# EasyEDA schematic SCH_Smart_Card_Contactless_Raspberry_Pi_2022-03-11.json
TITLE: Smart Card Contactless Raspberry Pi; REV: 1.0; Date: 2022-03-11; Sheet: 1/1; Drawn By: amusarra; Company: Antonio Musarra's Blog
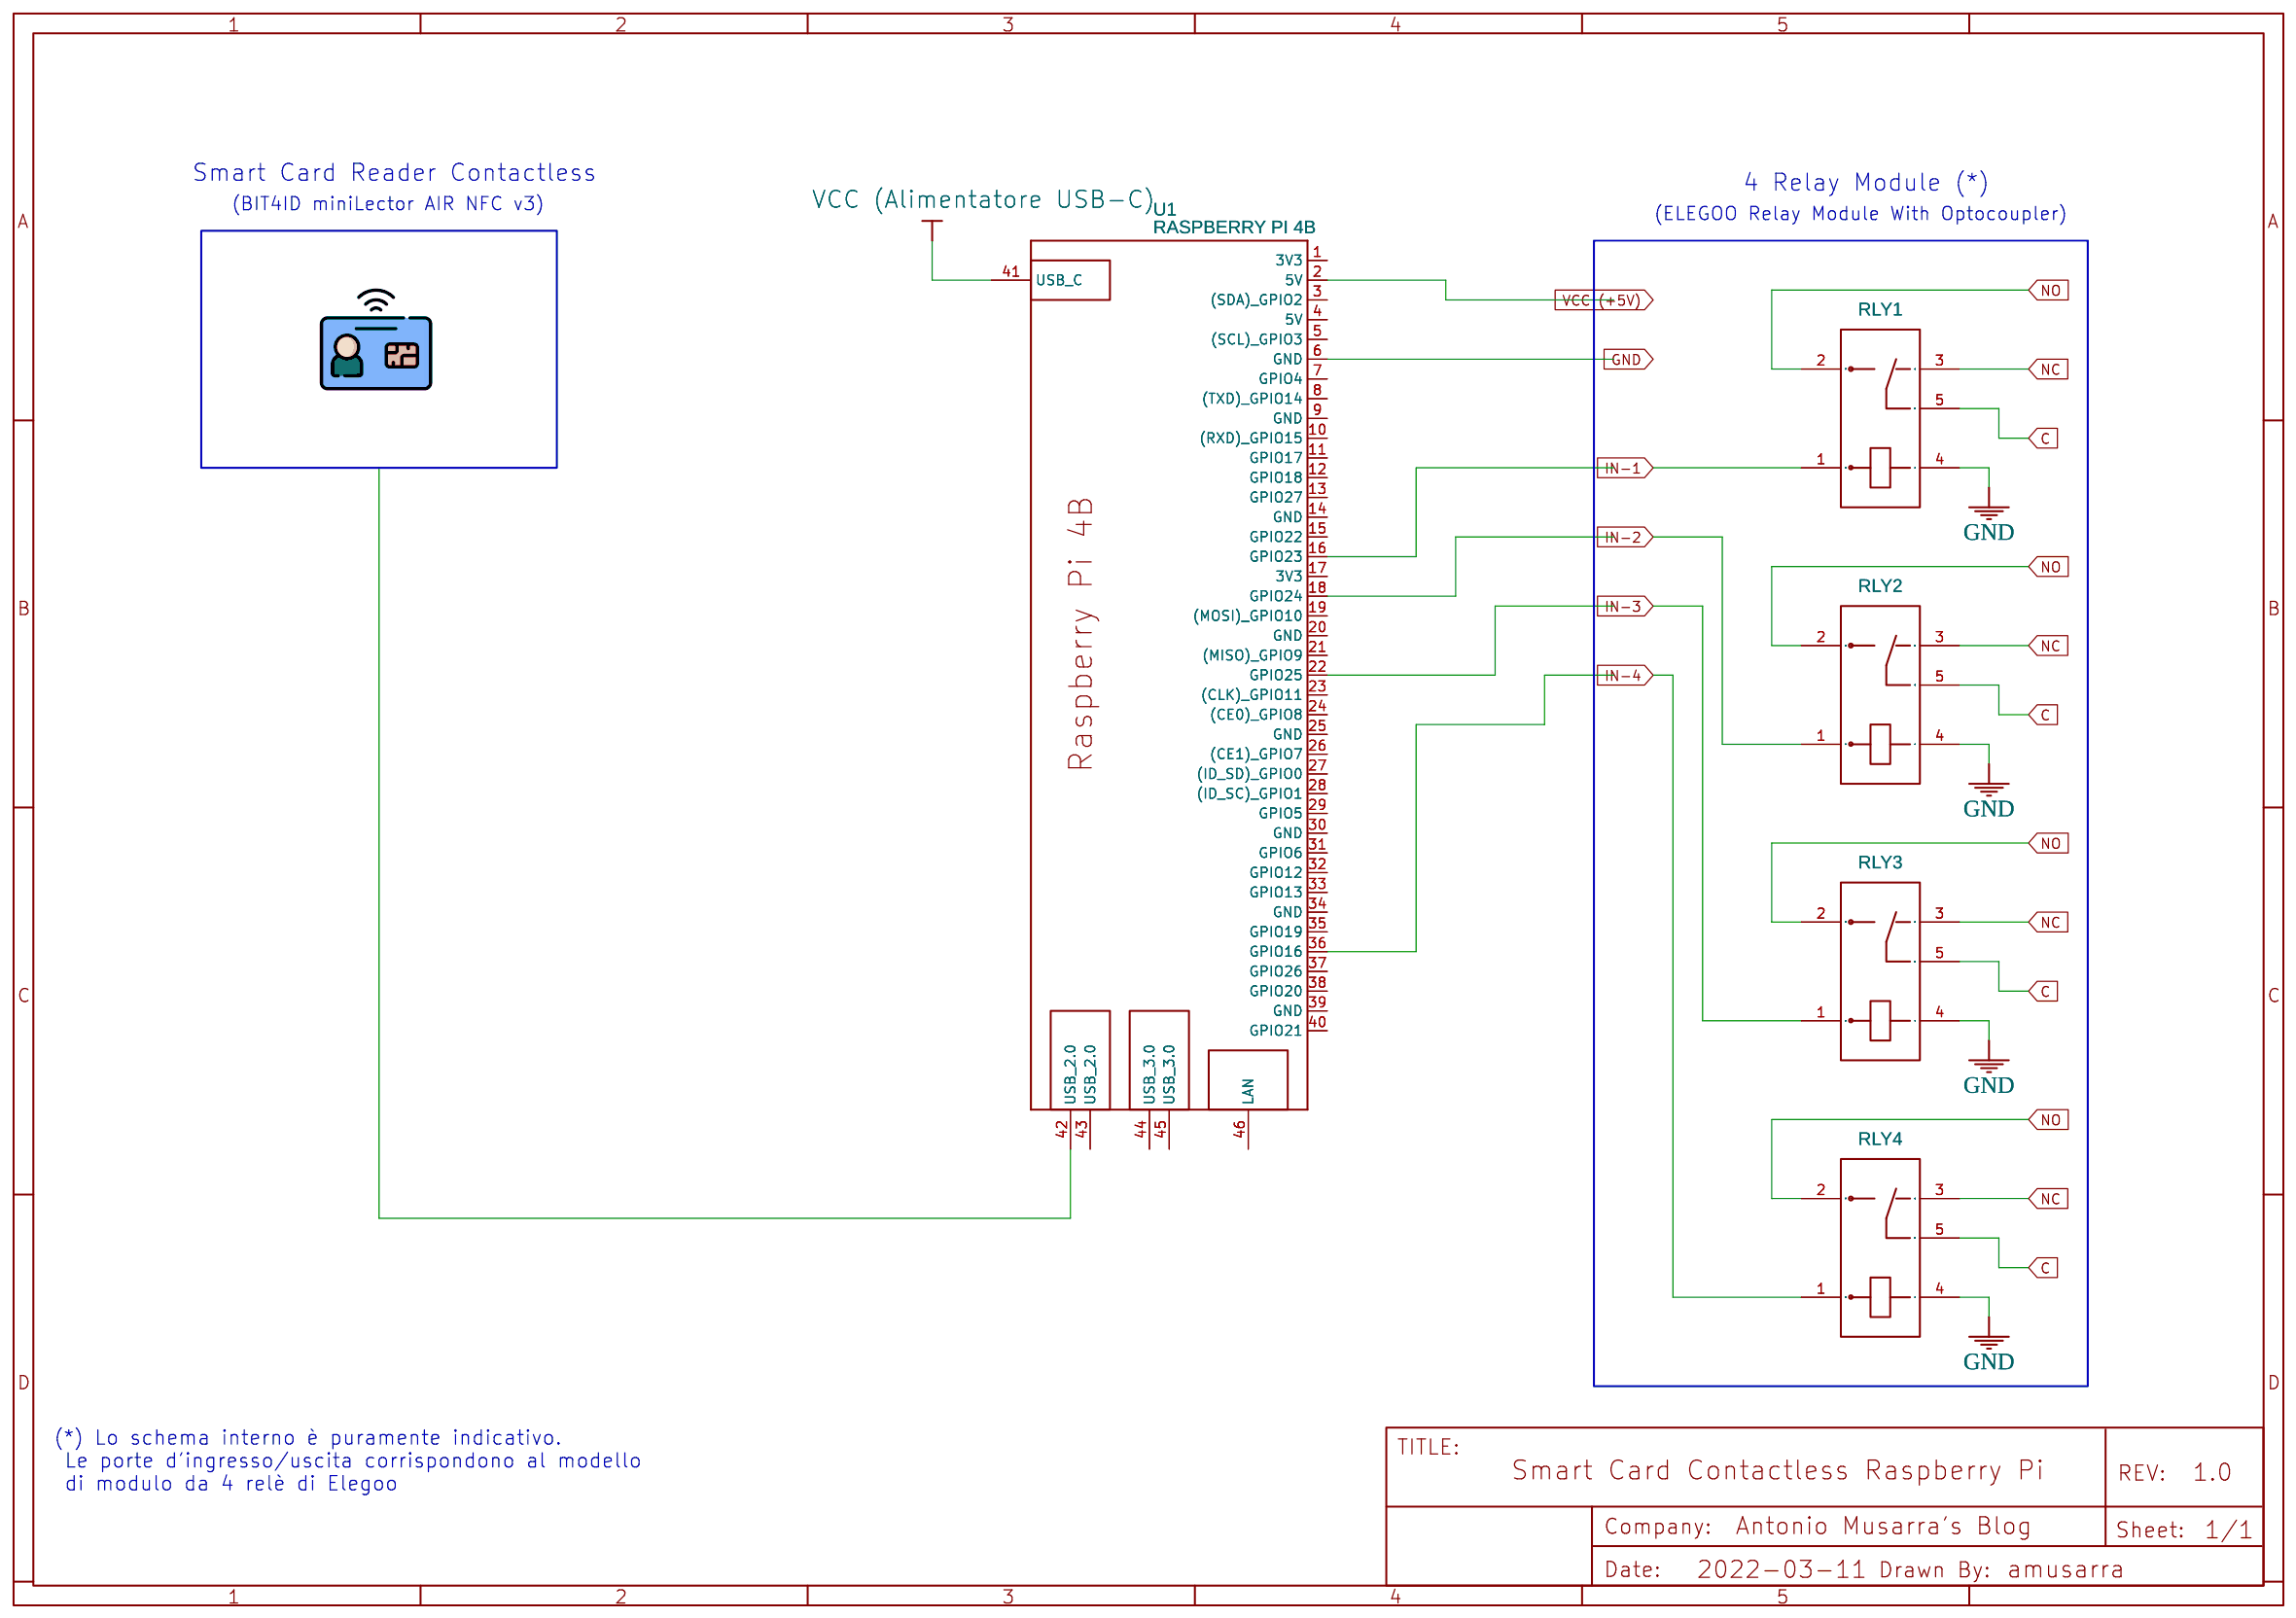
[diagram p0: schematic sheet]

## Parts
RLY1  SRD-05VDC-SL-C  [RELAY-TH_SRD-XXVDC-XL-C]
RLY2  SRD-05VDC-SL-C  [RELAY-TH_SRD-XXVDC-XL-C]
RLY3  SRD-05VDC-SL-C  [RELAY-TH_SRD-XXVDC-XL-C]
RLY4  SRD-05VDC-SL-C  [RELAY-TH_SRD-XXVDC-XL-C]
U1  RASPBERRY PI 4B  [RASPBERRY PI 4B]

## Library data of the parts
RLY1 = SRD-05VDC-SL-C: Supplier: LCSC; Manufacturer: SONGLE; Supplier Part: C35449; JLCPCB Part Class: Extended Part; Package Display: No
RLY2-RLY4 = SRD-05VDC-SL-C: Supplier: LCSC; Manufacturer: SONGLE; Supplier Part: C35449; JLCPCB Part Class: Extended Part
U1 = RASPBERRY PI 4B: Manufacturer Part: Raspberry Pi; Contributor: DJ34

## Nets
GND: RLY1.4 RLY2.4 RLY3.4 RLY4.4
VCC (Alimentatore USB-C): U1.41(USB C)
C: RLY1.5 RLY2.5 RLY3.5 RLY4.5
IN-1: RLY1.1
IN-2: RLY2.1
IN-3: RLY3.1
IN-4: RLY4.1
NC: RLY1.3 RLY2.3 RLY3.3 RLY4.3
NO: RLY1.2 RLY2.2 RLY3.2 RLY4.2

Not connected (* = marked no-connect by the designer): U1 1(3V3) 2(5V) 3((SDA) GPIO2) 4(5V) 5((SCL) GPIO3) 6(GND) 7(GPIO4) 8((TXD) GPIO14) 9(GND) 10((RXD) GPIO15) 11(GPIO17) 12(GPIO18) 13(GPIO27) 14(GND) 15(GPIO22) 16(GPIO23) 17(3V3) 18(GPIO24) 19((MOSI) GPIO10) 20(GND) 21((MISO) GPIO9) 22(GPIO25) 23((CLK) GPIO11) 24((CE0) GPIO8) 25(GND) 26((CE1) GPIO7) 27((ID_SD) GPIO0) 28((ID_SC) GPIO1) 29(GPIO5) 30(GND) 31(GPIO6) 32(GPIO12) 33(GPIO13) 34(GND) 35(GPIO19) 36(GPIO16) 37(GPIO26) 38(GPIO20) 39(GND) 40(GPIO21) 42(USB 2.0) 43(USB 2.0) 44(USB 3.0) 45(USB 3.0) 46(LAN)

## Notes on the sheet
- Smart Card Reader Contactless
- 4 Relay Module (*)
- (BIT4ID miniLector AIR NFC v3)
- (ELEGOO Relay Module With Optocoupler)
- (*) Lo schema interno è puramente indicativo.
   Le porte d'ingresso/uscita corrispondono al modello
   di modulo da 4 relè di Elegoo
